# Altium schematic sheet plata_verhn.SchDoc
size A4
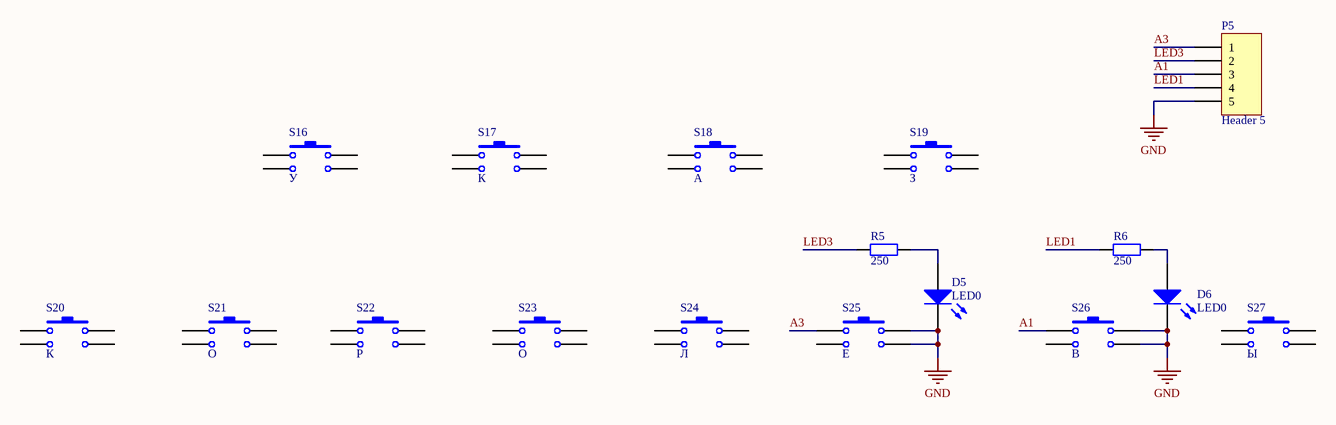
[diagram p0: plata_verhn.SchDoc]

## Parts
D5  LED0  [LED0805]
D6  LED0  [LED0805]
P5  Header 5  [HDR1X5]
R5  250  [6-0805_N]
R6  250  [6-0805_N]
S16  У  [STMW]
S17  К  [STMW]
S18  А  [STMW]
S19  З  [STMW]
S20  К  [STMW]
S21  О  [STMW]
S22  Р  [STMW]
S23  О  [STMW]
S24  Л  [STMW]
S25  Е  [STMW]
S26  В  [STMW]
S27  Ы  [STMW]

## Nets
GND: D5.2(K) D6.2(K) P5.5 S25.2 S26.2
A1: P5.3 S26.1
A3: P5.1 S25.1
LED1: P5.4 R6.2
LED3: P5.2 R5.2
NetD5_1: D5.1(A) R5.1
NetD6_1: D6.1(A) R6.1

Not connected (* = marked no-connect by the designer): S16 1 2; S17 1 2; S18 1 2; S19 1 2; S20 1 2; S21 1 2; S22 1 2; S23 1 2; S24 1 2; S27 1 2

## Library data of the parts
D5 D6 = LED0: Typical INFRARED GaAs LED; Published: 8-Jun-2000; LatestRevisionDate: 08-Jul-2005; LatestRevisionNote: Mech Layer 1 removed.; PackageReference: LED-0; Publisher: Altium Limited; PackageDescription: LED; 2 Leads
P5 = Header 5: Header, 5-Pin; LatestRevisionDate: 17-Jul-2002; LatestRevisionNote: Re-released for DXP Platform.; Publisher: Altium Limited
R5 R6 = Res2: Resistor; Value: 1K; Published: 8-Jun-2000; LatestRevisionDate: 17-Jul-2002; LatestRevisionNote: Re-released for DXP Platform.; PackageReference: AXIAL-0.4; Publisher: Altium Limited; PackageDescription: Axial Device, Thru-Hole; 2 Leads; 0.4 in Pin Spacing
S16-S27 = STMW: Switch; Published: 24-Mar-1999; LatestRevisionDate: 17-Jul-2002; LatestRevisionNote: Re-released for DXP Platform.; PackageReference: SPST-2; Publisher: Altium Limited; PackageDescription: Switch; 2 Leads